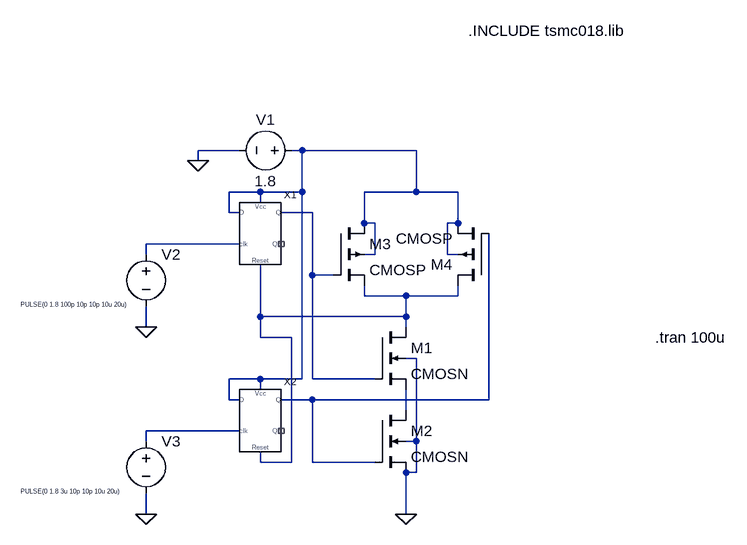
[diagram p0: schematic test.asc]
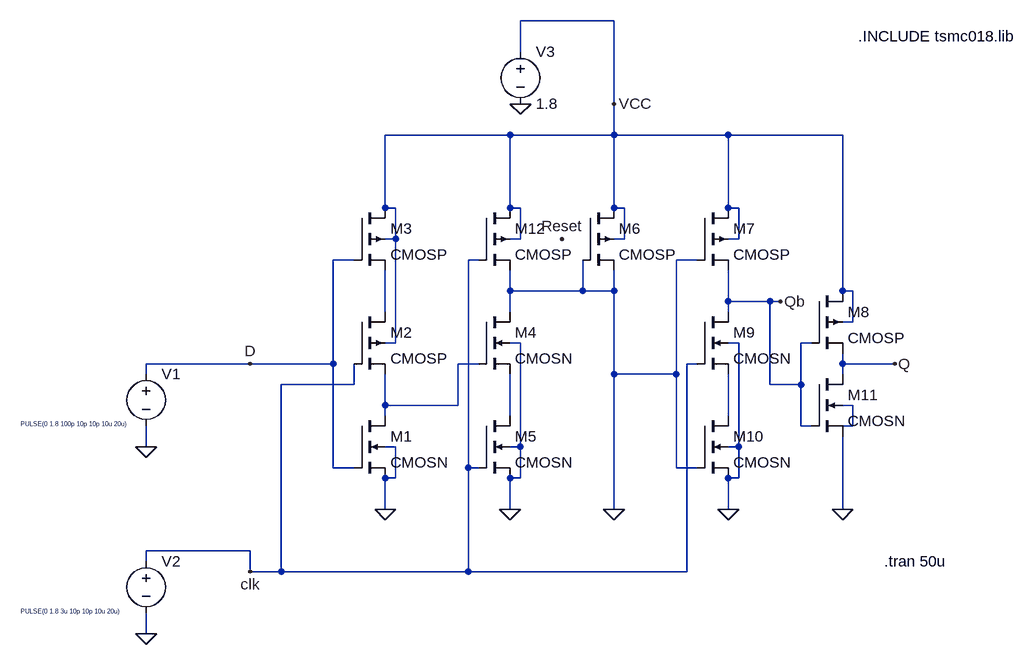
[diagram p1: sub-circuit d_ff.asc]
test.asc, the LTspice schematic file:
Version 4
SHEET 1 892 680
WIRE 128 -32 64 -32
WIRE 224 -32 208 -32
WIRE 400 -32 224 -32
WIRE 64 -16 64 -32
WIRE 160 32 112 32
WIRE 224 32 224 -32
WIRE 224 32 160 32
WIRE 400 32 400 -32
WIRE 400 32 320 32
WIRE 464 32 400 32
WIRE 160 48 160 32
WIRE 112 64 112 32
WIRE 128 64 112 64
WIRE 240 64 192 64
WIRE 320 80 320 32
WIRE 336 80 320 80
WIRE 464 80 464 32
WIRE 464 80 448 80
WIRE 128 112 -16 112
WIRE -16 128 -16 112
WIRE 336 128 336 80
WIRE 336 128 320 128
WIRE 448 128 448 80
WIRE 464 128 448 128
WIRE 240 160 240 64
WIRE 272 160 240 160
WIRE 320 192 320 176
WIRE 384 192 320 192
WIRE 464 192 464 176
WIRE 464 192 384 192
WIRE 160 224 160 144
WIRE 384 224 384 192
WIRE 384 224 160 224
WIRE -16 240 -16 208
WIRE 384 240 384 224
WIRE 160 256 160 224
WIRE 208 256 160 256
WIRE 400 288 384 288
WIRE 160 320 112 320
WIRE 224 320 224 32
WIRE 224 320 160 320
WIRE 240 320 240 160
WIRE 336 320 240 320
WIRE 160 336 160 320
WIRE 112 352 112 320
WIRE 128 352 112 352
WIRE 240 352 192 352
WIRE 512 352 512 96
WIRE 512 352 240 352
WIRE 384 368 384 336
WIRE 128 400 -16 400
WIRE -16 416 -16 400
WIRE 400 416 400 288
WIRE 400 416 384 416
WIRE 160 448 160 432
WIRE 208 448 208 256
WIRE 208 448 160 448
WIRE 240 448 240 352
WIRE 336 448 240 448
WIRE 400 464 400 416
WIRE 400 464 384 464
WIRE -16 528 -16 496
WIRE 384 528 384 464
FLAG -16 240 0
FLAG -16 528 0
FLAG 384 528 0
FLAG 64 -16 0
SYMBOL d_ff 144 96 R0
SYMATTR InstName X1
SYMBOL d_ff 144 384 R0
SYMATTR InstName X2
SYMBOL cmosn 336 240 R0
SYMATTR InstName M1
SYMATTR Value2 l=180n w=1u
SYMBOL cmosn 336 368 R0
SYMATTR InstName M2
SYMATTR Value2 l=180n w=1u
SYMBOL cmosp 272 80 R0
SYMATTR InstName M3
SYMATTR Value2 l=180n w=1u
SYMBOL cmosp 512 176 R180
SYMATTR InstName M4
SYMATTR Value2 l=180n w=1u
SYMBOL voltage 224 -32 R90
WINDOW 0 -32 56 VBottom 2
WINDOW 3 32 56 VTop 2
WINDOW 123 0 0 Left 0
WINDOW 39 0 0 Left 0
SYMATTR InstName V1
SYMATTR Value 1.8
SYMBOL voltage -16 112 R0
WINDOW 3 -193 93 Left 0
WINDOW 123 0 0 Left 0
WINDOW 39 0 0 Left 0
SYMATTR InstName V2
SYMATTR Value PULSE(0 1.8 100p 10p 10p 10u 20u)
SYMBOL voltage -16 400 R0
WINDOW 3 -193 93 Left 0
WINDOW 123 0 0 Left 0
WINDOW 39 0 0 Left 0
SYMATTR InstName V3
SYMATTR Value PULSE(0 1.8 3u 10p 10p 10u 20u)
TEXT 480 -216 Left 2 !.INCLUDE tsmc018.lib
TEXT 768 256 Left 2 !.tran 100u

d_ff.asc, the sub-circuit schematic file:
Version 4
SHEET 1 1148 680
WIRE 512 -448 368 -448
WIRE 368 -400 368 -448
WIRE 512 -320 512 -448
WIRE 352 -272 160 -272
WIRE 512 -272 512 -320
WIRE 512 -272 352 -272
WIRE 688 -272 512 -272
WIRE 864 -272 688 -272
WIRE 160 -160 160 -272
WIRE 176 -160 160 -160
WIRE 352 -160 352 -272
WIRE 368 -160 352 -160
WIRE 512 -160 512 -272
WIRE 528 -160 512 -160
WIRE 688 -160 688 -272
WIRE 704 -160 688 -160
WIRE 176 -112 176 -160
WIRE 176 -112 160 -112
WIRE 368 -112 368 -160
WIRE 368 -112 352 -112
WIRE 528 -112 528 -160
WIRE 528 -112 512 -112
WIRE 704 -112 704 -160
WIRE 704 -112 688 -112
WIRE 112 -80 80 -80
WIRE 304 -80 288 -80
WIRE 640 -80 608 -80
WIRE 352 -32 352 -64
WIRE 464 -32 464 -80
WIRE 464 -32 352 -32
WIRE 512 -32 512 -64
WIRE 512 -32 464 -32
WIRE 864 -32 864 -272
WIRE 880 -32 864 -32
WIRE 688 -16 688 -64
WIRE 752 -16 688 -16
WIRE 768 -16 752 -16
WIRE 160 0 160 -64
WIRE 352 0 352 -32
WIRE 688 0 688 -16
WIRE 880 16 880 -32
WIRE 880 16 864 16
WIRE 176 48 176 -112
WIRE 176 48 160 48
WIRE 368 48 352 48
WIRE 704 48 688 48
WIRE 816 48 800 48
WIRE -48 80 -208 80
WIRE 80 80 80 -80
WIRE 80 80 -48 80
WIRE 304 80 272 80
WIRE 640 80 624 80
WIRE 864 80 864 64
WIRE 944 80 864 80
WIRE -208 96 -208 80
WIRE 512 96 512 -32
WIRE 608 96 608 -80
WIRE 608 96 512 96
WIRE 864 96 864 80
WIRE 112 112 112 80
WIRE 112 112 0 112
WIRE 752 112 752 -16
WIRE 800 112 800 48
WIRE 800 112 752 112
WIRE 160 144 160 96
WIRE 272 144 272 80
WIRE 272 144 160 144
WIRE 880 144 864 144
WIRE 160 160 160 144
WIRE 352 160 352 96
WIRE 688 160 688 96
WIRE 800 176 800 112
WIRE 816 176 800 176
WIRE 880 176 880 144
WIRE 880 176 864 176
WIRE -208 208 -208 176
WIRE 176 208 160 208
WIRE 368 208 368 48
WIRE 368 208 352 208
WIRE 704 208 704 48
WIRE 704 208 688 208
WIRE 80 240 80 80
WIRE 112 240 80 240
WIRE 288 240 288 -80
WIRE 304 240 288 240
WIRE 608 240 608 96
WIRE 640 240 608 240
WIRE 176 256 176 208
WIRE 176 256 160 256
WIRE 368 256 368 208
WIRE 368 256 352 256
WIRE 704 256 704 208
WIRE 704 256 688 256
WIRE 160 304 160 256
WIRE 352 304 352 256
WIRE 512 304 512 96
WIRE 688 304 688 256
WIRE 864 304 864 192
WIRE -48 368 -208 368
WIRE -208 384 -208 368
WIRE -48 400 -48 368
WIRE 0 400 0 112
WIRE 0 400 -48 400
WIRE 288 400 288 240
WIRE 288 400 0 400
WIRE 624 400 624 80
WIRE 624 400 288 400
WIRE -208 496 -208 464
FLAG -48 400 clk
FLAG 688 304 0
FLAG 160 304 0
FLAG 352 304 0
FLAG 512 304 0
FLAG 864 304 0
FLAG 512 -320 VCC
FLAG -48 80 D
FLAG 944 80 Q
FLAG 768 -16 Qb
FLAG 432 -112 Reset
FLAG -208 208 0
FLAG -208 496 0
FLAG 368 -320 0
SYMBOL cmosp 112 0 R0
SYMATTR InstName M2
SYMATTR Value2 l=180n w=1u
SYMBOL cmosp 112 -160 R0
SYMATTR InstName M3
SYMATTR Value2 l=180n w=1u
SYMBOL cmosn 112 160 R0
SYMATTR InstName M1
SYMATTR Value2 l=180n w=1u
SYMBOL cmosn 304 0 R0
SYMATTR InstName M4
SYMATTR Value2 l=180n w=1u
SYMBOL cmosn 304 160 R0
SYMATTR InstName M5
SYMATTR Value2 l=180n w=1u
SYMBOL cmosp 464 -160 R0
SYMATTR InstName M6
SYMATTR Value2 l=180n w=1u
SYMBOL cmosp 640 -160 R0
SYMATTR InstName M7
SYMATTR Value2 l=180n w=1u
SYMBOL cmosp 816 -32 R0
SYMATTR InstName M8
SYMATTR Value2 l=180n w=1u
SYMBOL cmosn 640 0 R0
SYMATTR InstName M9
SYMATTR Value2 l=180n w=1u
SYMBOL cmosn 640 160 R0
SYMATTR InstName M10
SYMATTR Value2 l=180n w=1u
SYMBOL cmosn 816 96 R0
SYMATTR InstName M11
SYMATTR Value2 l=180n w=1u
SYMBOL cmosp 304 -160 R0
SYMATTR InstName M12
SYMATTR Value2 l=180n w=1u
SYMBOL voltage -208 80 R0
WINDOW 3 -193 93 Left 0
WINDOW 123 0 0 Left 0
WINDOW 39 0 0 Left 0
SYMATTR InstName V1
SYMATTR Value PULSE(0 1.8 100p 10p 10p 10u 20u)
SYMBOL voltage -208 368 R0
WINDOW 3 -193 93 Left 0
WINDOW 123 0 0 Left 0
WINDOW 39 0 0 Left 0
SYMATTR InstName V2
SYMATTR Value PULSE(0 1.8 3u 10p 10p 10u 20u)
SYMBOL voltage 368 -416 R0
WINDOW 123 0 0 Left 0
WINDOW 39 0 0 Left 0
SYMATTR InstName V3
SYMATTR Value 1.8
TEXT 888 -424 Left 2 !.INCLUDE tsmc018.lib
TEXT 928 384 Left 2 !.tran 50u

The netlist it stands for:
* test.asc
XX1 N001 N001 N002 NC_01 N003 N004 d_ff
XX2 N001 N001 N005 NC_02 N007 N004 d_ff
M1 N004 N002 N006 0 CMOSN l=180n w=1u
M2 N006 N005 0 0 CMOSN l=180n w=1u
M3 N001 N002 N004 N001 CMOSP l=180n w=1u
M4 N004 N005 N001 N001 CMOSP l=180n w=1u
V1 N001 0 1.8
V2 N003 0 PULSE(0 1.8 100p 10p 10p 10u 20u)
V3 N007 0 PULSE(0 1.8 3u 10p 10p 10u 20u)

* block symbol definitions
.subckt d_ff VCC D Q Qb clk Reset
M2 N001 clk N002 VCC CMOSP l=180n w=1u
M3 VCC D N001 VCC CMOSP l=180n w=1u
M1 N002 D 0 0 CMOSN l=180n w=1u
M4 0 N002 N004 0 CMOSN l=180n w=1u
M5 N004 clk 0 0 CMOSN l=180n w=1u
M6 VCC 0 0 VCC CMOSP l=180n w=1u
M7 VCC 0 Qb VCC CMOSP l=180n w=1u
M8 VCC Qb Q VCC CMOSP l=180n w=1u
M9 Qb clk N005 0 CMOSN l=180n w=1u
M10 N005 0 0 0 CMOSN l=180n w=1u
M11 Q Qb 0 N003 CMOSN l=180n w=1u
M12 VCC clk 0 VCC CMOSP l=180n w=1u
V1 D 0 PULSE(0 1.8 100p 10p 10p 10u 20u)
V2 clk 0 PULSE(0 1.8 3u 10p 10p 10u 20u)
V3 VCC 0 1.8
.INCLUDE tsmc018.lib
.tran 50u
.ends d_ff

.model NMOS NMOS
.model PMOS PMOS
.lib standard.mos
.INCLUDE tsmc018.lib
.tran 100u
.backanno
.end